# EasyEDA schematic SpotiFi.json
TITLE: Sheet_1; REV: 1.0; Date: 2026-06-07; Sheet: 1/1; Company: Your Company
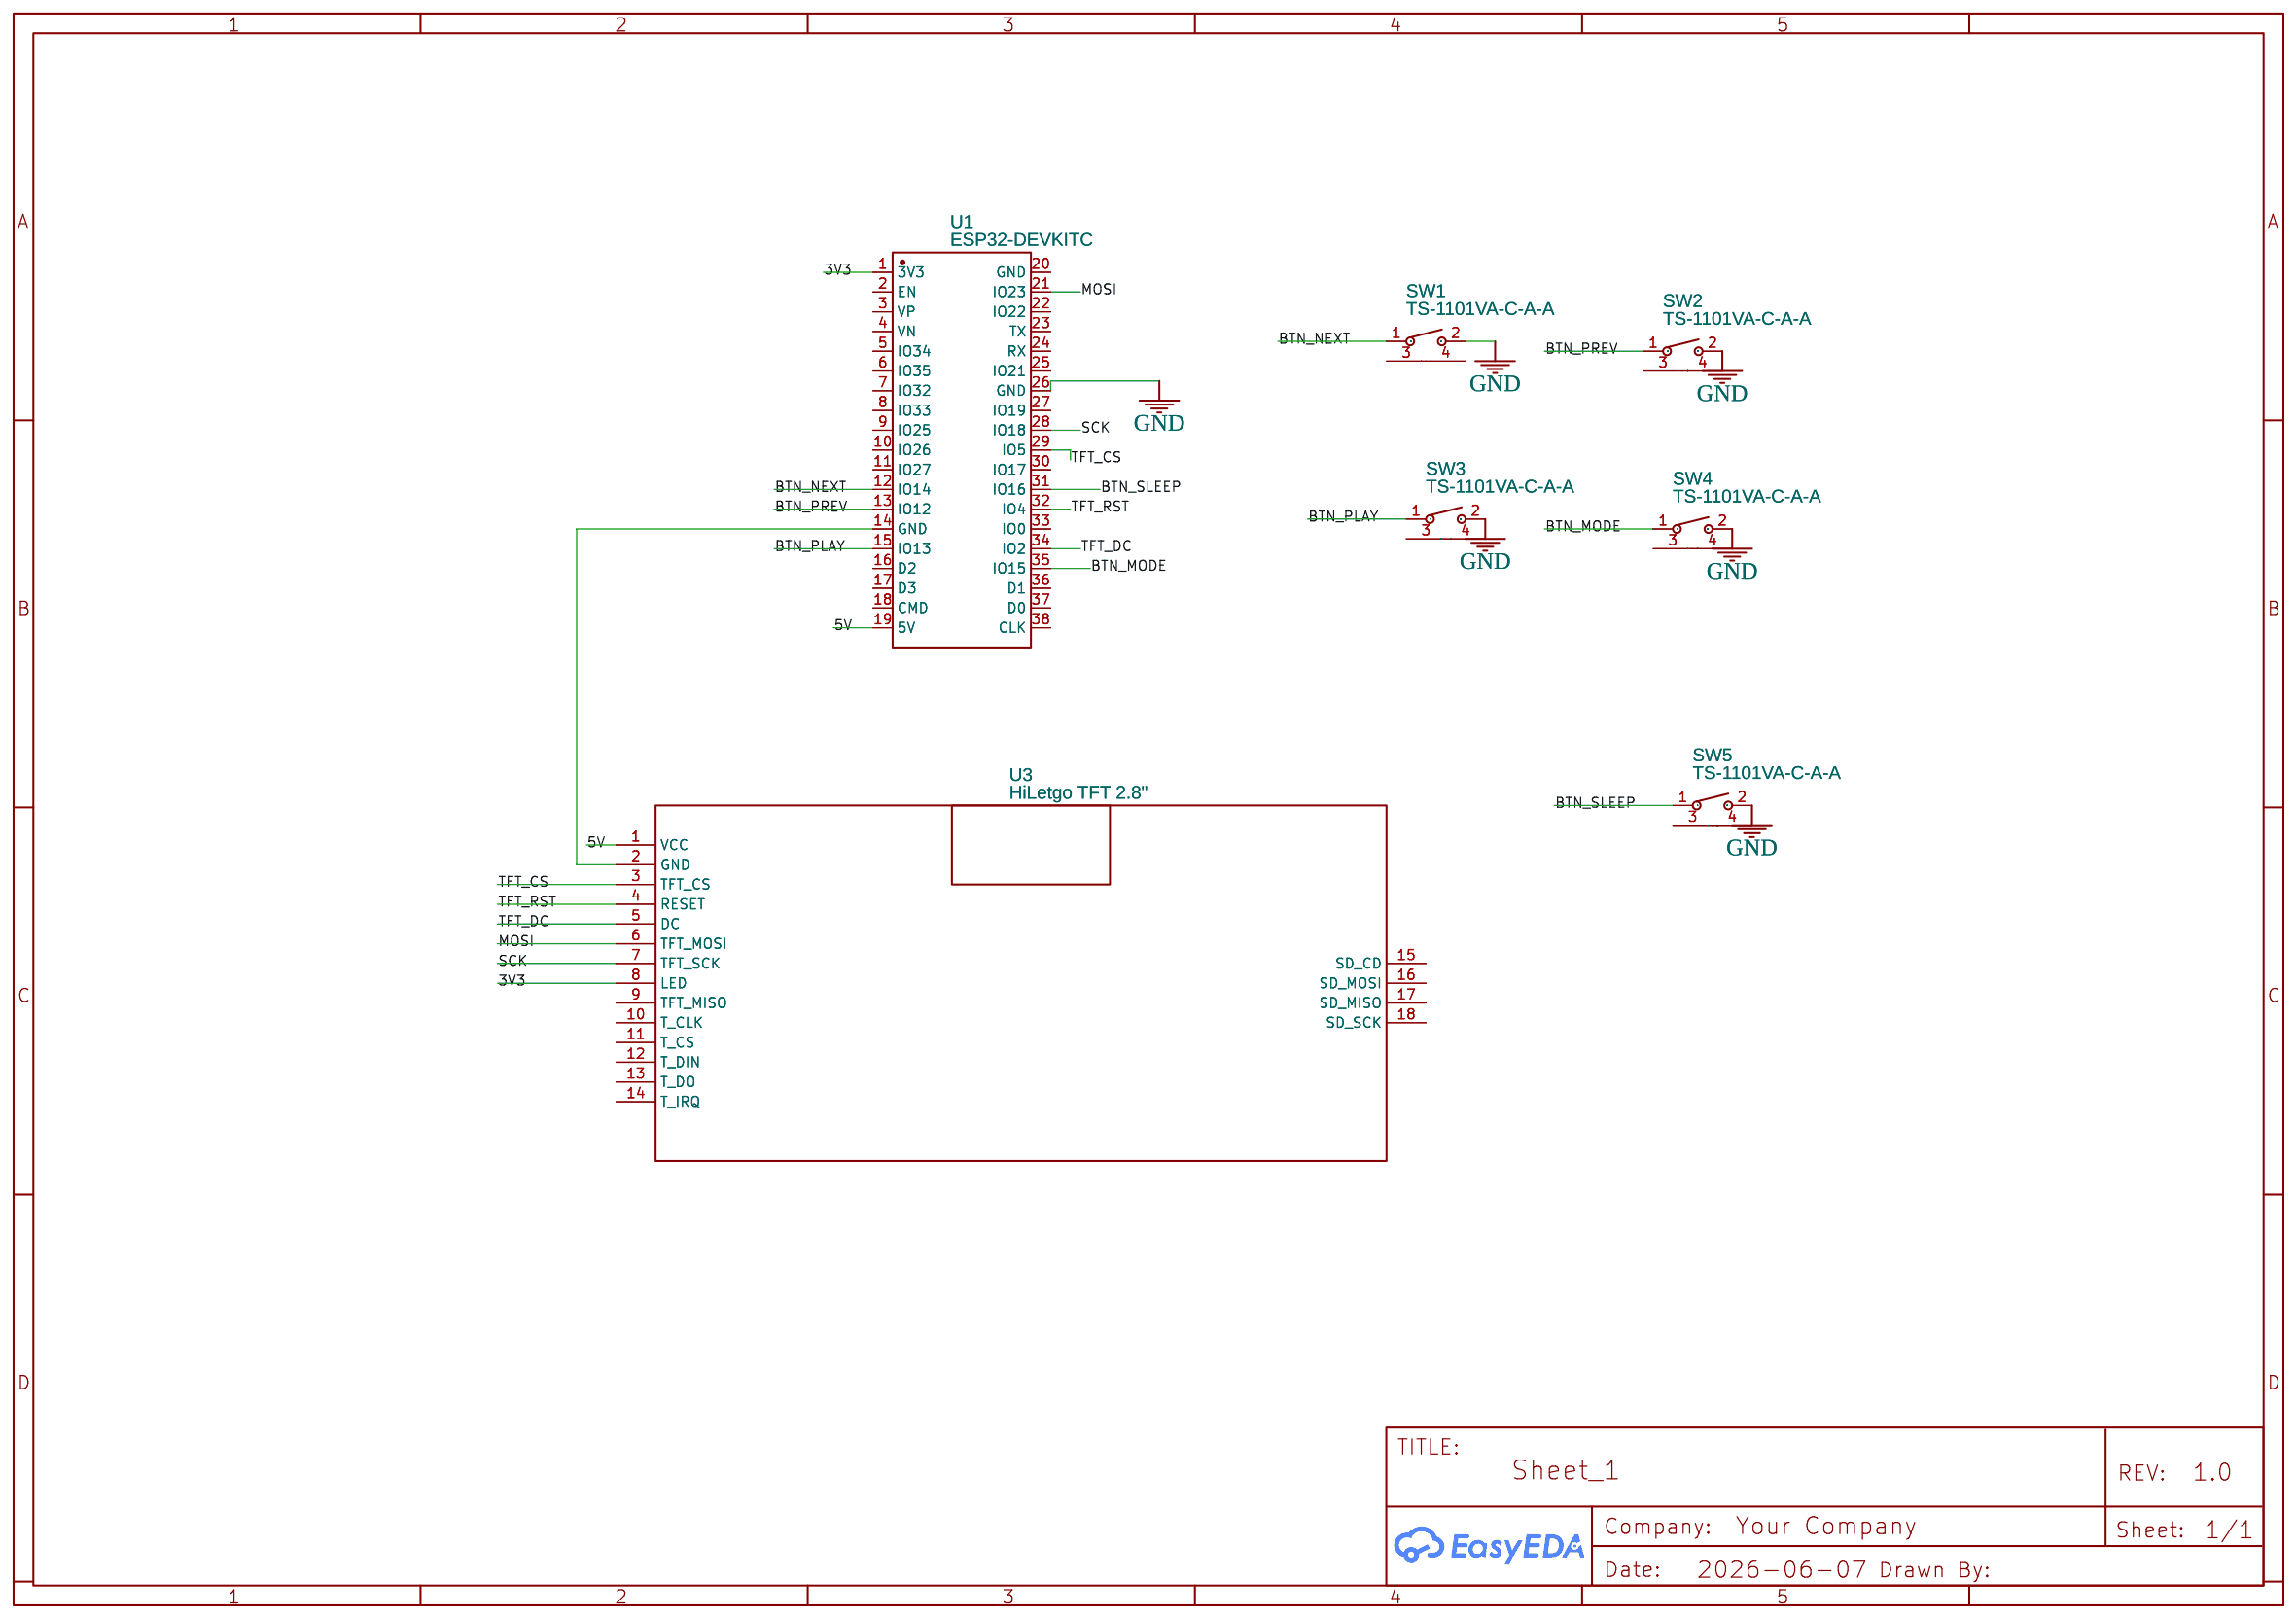
[diagram p0: schematic sheet]

## Parts
SW1  TS-1101VA-C-A-A  [SW-SMD_XKB_TS-1101VA-C-A-A]
SW2  TS-1101VA-C-A-A  [SW-SMD_XKB_TS-1101VA-C-A-A]
SW3  TS-1101VA-C-A-A  [SW-SMD_XKB_TS-1101VA-C-A-A]
SW4  TS-1101VA-C-A-A  [SW-SMD_XKB_TS-1101VA-C-A-A]
SW5  TS-1101VA-C-A-A  [SW-SMD_XKB_TS-1101VA-C-A-A]
U1  ESP32-DEVKITC  [BULETM-SMD_ESP32-DEVKITC]
U3  HiLetgo TFT 2.8"  [TFT HILETGO ILI9341 2.8" SPI TFT]

## Library data of the parts
SW1-SW5 = TS-1101VA-C-A-A: Contributor: LCSC; Supplier: LCSC; Supplier Part: C2885164; Manufacturer: XKB Connection(中国星坤); JLCPCB Part Class: Extended Part
U1 = ESP32-DEVKITC: Supplier: LCSC; Supplier Part: C571180; Manufacturer: ESPRESSIF(乐鑫); Manufacturer Part: ESP32-DevKitC; Contributor: lcsc
U3 = HiLetgo TFT 2.8": Contributor: dookie454

## Nets
3V3: U1.1(3V3) U3.8(LED)
5V: U1.19(5V) U3.1(VCC)
GND: SW1.2 SW2.2 SW3.2 SW4.2 SW5.2 U1.26(GND)
BTN_MODE: SW4.1 U1.35(IO15)
BTN_NEXT: SW1.1 U1.12(IO14)
BTN_PLAY: SW3.1 U1.15(IO13)
BTN_PREV: SW2.1 U1.13(IO12)
BTN_SLEEP: SW5.1 U1.31(IO16)
MOSI: U1.21(IO23) U3.6(TFT MOSI)
SCK: U1.28(IO18) U3.7(TFT SCK)
TFT_CS: U1.29(IO5) U3.3(TFT CS)
TFT_DC: U1.34(IO2) U3.5(DC)
TFT_RST: U1.32(IO4) U3.4(RESET)
Net-(U1-14): U1.14(GND) U3.2(GND)

Not connected (* = marked no-connect by the designer): SW1 3 4; SW2 3 4; SW3 3 4; SW4 3 4; SW5 3 4; U1 2(EN) 3(VP) 4(VN) 5(IO34) 6(IO35) 7(IO32) 8(IO33) 9(IO25) 10(IO26) 11(IO27) 16(D2) 17(D3) 18(CMD) 20(GND) 22(IO22) 23(TX) 24(RX) 25(IO21) 27(IO19) 30(IO17) 33(IO0) 36(D1) 37(D0) 38(CLK); U3 9(TFT MISO) 10(T CLK) 11(T CS) 12(T DIN) 13(T DO) 14(T IRQ) 15(SD CD) 16(SD MOSI) 17(SD MISO) 18(SD SCK)
